# Altium schematic sheet Main.SchDoc
size A3; SheetNumber: 1; SheetTotal: 3
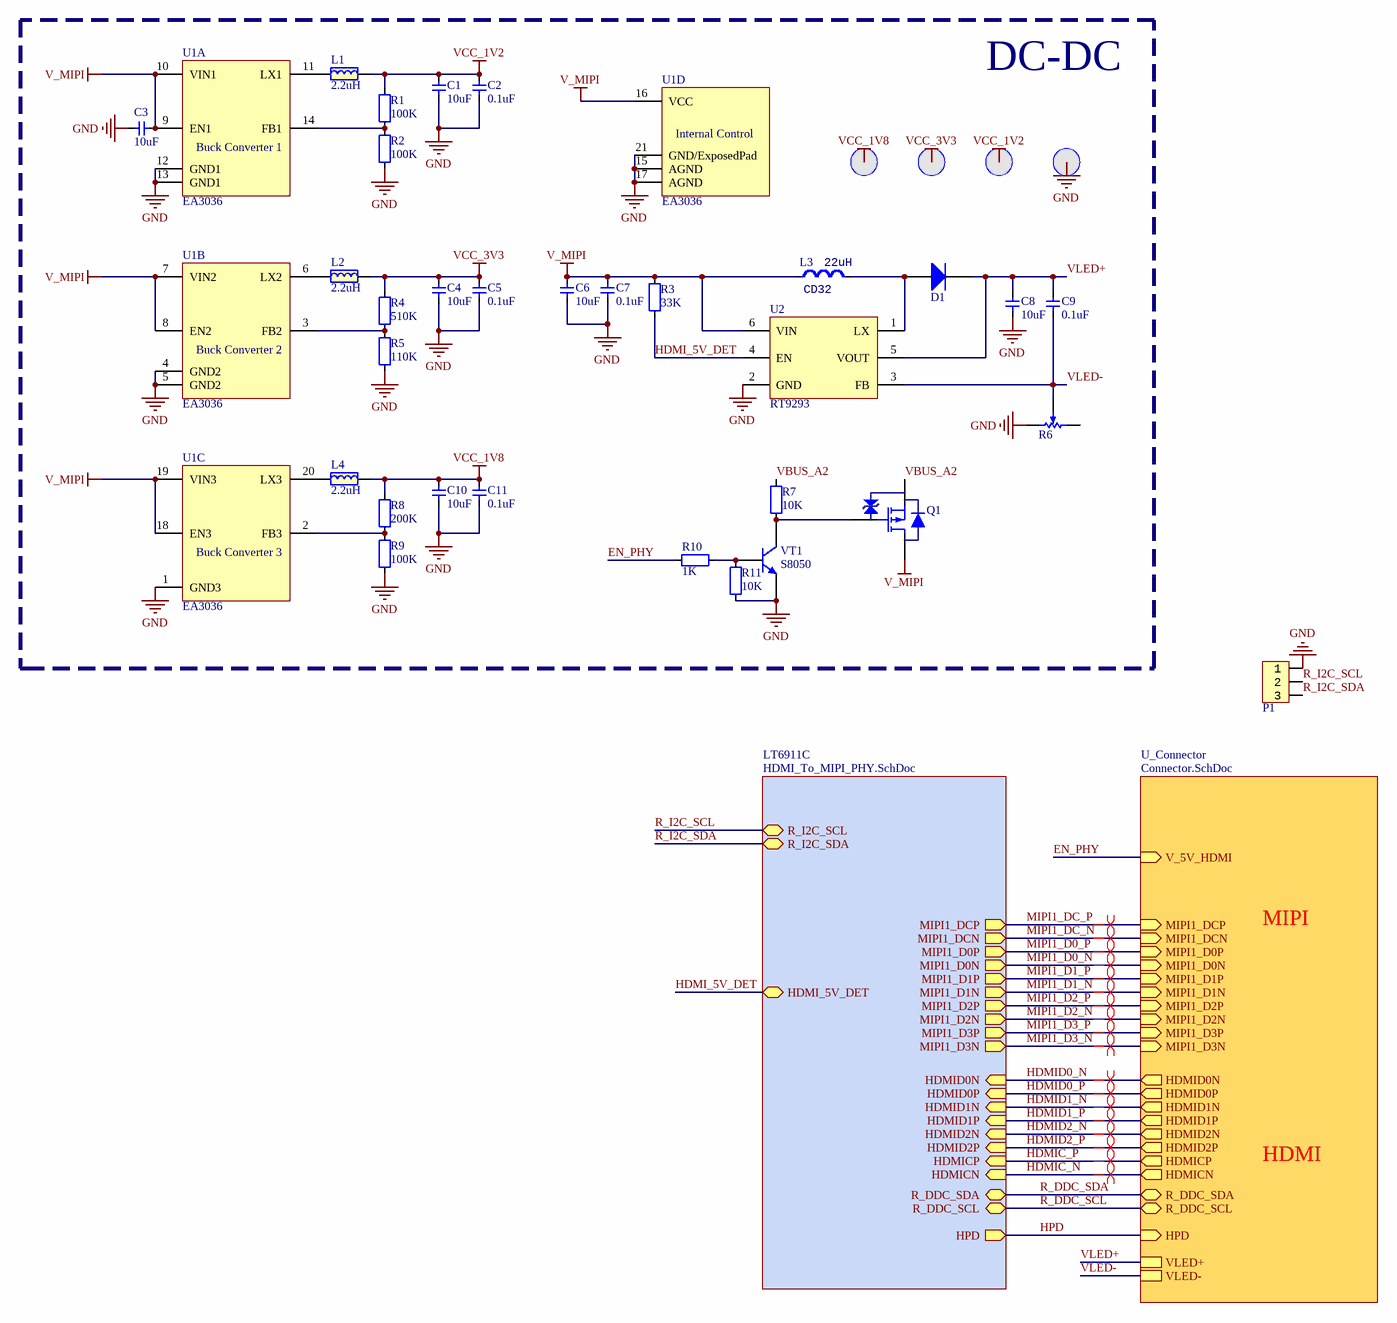
[diagram p0: Main.SchDoc]

## Parts
C1  10uF  [CAP_0402]
C2  0.1uF  [CAP_0402]
C3  10uF  [CAP_0402]
C4  10uF  [CAP_0402]
C5  0.1uF  [CAP_0402]
C6  10uF  [CAP_0402]
C7  0.1uF  [CAP_0402]
C8  10uF  [CAP_0402]
C9  0.1uF  [CAP_0402]
C10  10uF  [CAP_0402]
C11  0.1uF  [CAP_0402]
D1  二极管-5B5817WS  [SOD-323]  (value not drawn)
L1  2.2uH  [2520-L]
L2  2.2uH  [2520-L]
L3  value 22uH  [IND_CD32]  (hidden comment: CD32)
L4  2.2uH  [2520-L]
P1  HDR1x3_2.54  [HDR1X3_2.54_90]  (value not drawn)
Q1  AO3415A  [SOT23-3]  (value not drawn)
R1  100K  [RES_0402]
R2  100K  [RES_0402]
R3  33K  [RES_0402]
R4  510K  [RES_0402]
R5  110K  [RES_0402]
R6  电位器-贴片  [贴片电位器 3*3]  (value not drawn)
R7  10K  [RES_0402]
R8  200K  [RES_0402]
R9  100K  [RES_0402]
R10  1K  [RES_0402]
R11  10K  [RES_0402]
T1  测试点  [TEST_PT]  (value not drawn)
T2  测试点  [TEST_PT]  (value not drawn)
T3  测试点  [TEST_PT]  (value not drawn)
T4  测试点  [TEST_PT]  (value not drawn)
U1  EA3036  [QFN-20]  (parts A,B,C,D of 4)
U2  RT9293  [SOT23-6]
VT1  S8050  [SMT_TRIODE_NPN]

## Blocks framed on the sheet
DC-DC: C1-C11 D1 L1-L4 Q1 R1-R11 T1-T4 U1 U2 VT1

## Sub-sheets
LT6911C = HDMI_To_MIPI_PHY.SchDoc: R_I2C_SDA (bidir), R_I2C_SCL (bidir), HDMID0N (in), HDMID0P (in), HDMID1N (in), HDMID1P (in), HDMID2N (in), HDMID2P (in), HDMICP (in), HDMICN (in), R_DDC_SDA (bidir), R_DDC_SCL (bidir), MIPI1_DCP (out), MIPI1_DCN (out), MIPI1_D0P (out), MIPI1_D0N (out), MIPI1_D1P (out), MIPI1_D1N (out), MIPI1_D2P (out), MIPI1_D2N (out), MIPI1_D3P (out), MIPI1_D3N (out), HPD (out), HDMI_5V_DET (bidir)
U_Connector = Connector.SchDoc: MIPI1_DCP (in), MIPI1_DCN (in), MIPI1_D0P (in), MIPI1_D0N (in), MIPI1_D1P (in), MIPI1_D1N (in), MIPI1_D2P (in), MIPI1_D2N (in), MIPI1_D3P (in), MIPI1_D3N (in), R_DDC_SDA (bidir), R_DDC_SCL (bidir), HDMICP (out), HDMICN (out), HDMID0N (out), HDMID2P (out), HDMID1N (out), HDMID0P (out), HDMID1P (out), HDMID2N (out), HPD (in), VLED+, VLED-, V_5V_HDMI (in)

## Nets
GND: C1.2 C2.2 C3.1 C4.2 C5.2 C6.1 C7.1 C8.1 C10.2 C11.2 P1.1 R2.1 R5.1 R6.1(+) R9.1 R11.2 T4.0 U1.1(GND3) U1.4(GND2) U1.5(GND2) U1.12(GND1) U1.13(GND1) U1.15(AGND) U1.17(AGND) U1.21(GND/ExposedPad) U2.2(GND) VT1.2(E)
V_MIPI: C3.2 C6.2 C7.2 L3.1 Q1.3(D) R3.2 U1.7(VIN2) U1.8(EN2) U1.9(EN1) U1.10(VIN1) U1.16(VCC) U1.18(EN3) U1.19(VIN3) U2.6(VIN)
VCC_1V2: C1.1 C2.1 L1.2 R1.2 T3.0
VCC_1V8: C10.1 C11.1 L4.2 R8.2 T1.0
VCC_3V3: C4.1 C5.1 L2.2 R4.2 T2.0
EN_PHY: R10.2 ; sheet U_Connector/V_5V_HDMI
HDMI_5V_DET: R3.1 U2.4(EN) ; sheet LT6911C/HDMI_5V_DET
HDMIC_N: sheet LT6911C/HDMICN, sheet U_Connector/HDMICN
HDMIC_P: sheet LT6911C/HDMICP, sheet U_Connector/HDMICP
HDMID0_N: sheet LT6911C/HDMID0N, sheet U_Connector/HDMID0N
HDMID0_P: sheet LT6911C/HDMID0P, sheet U_Connector/HDMID0P
HDMID1_N: sheet LT6911C/HDMID1N, sheet U_Connector/HDMID1N
HDMID1_P: sheet LT6911C/HDMID1P, sheet U_Connector/HDMID1P
HDMID2_N: sheet LT6911C/HDMID2N, sheet U_Connector/HDMID2N
HDMID2_P: sheet LT6911C/HDMID2P, sheet U_Connector/HDMID2P
HPD: sheet LT6911C/HPD, sheet U_Connector/HPD
MIPI1_D0_N: sheet LT6911C/MIPI1_D0N, sheet U_Connector/MIPI1_D0N
MIPI1_D0_P: sheet LT6911C/MIPI1_D0P, sheet U_Connector/MIPI1_D0P
MIPI1_D1_N: sheet LT6911C/MIPI1_D1N, sheet U_Connector/MIPI1_D1N
MIPI1_D1_P: sheet LT6911C/MIPI1_D1P, sheet U_Connector/MIPI1_D1P
MIPI1_D2_N: sheet LT6911C/MIPI1_D2N, sheet U_Connector/MIPI1_D2N
MIPI1_D2_P: sheet LT6911C/MIPI1_D2P, sheet U_Connector/MIPI1_D2P
MIPI1_D3_N: sheet LT6911C/MIPI1_D3N, sheet U_Connector/MIPI1_D3N
MIPI1_D3_P: sheet LT6911C/MIPI1_D3P, sheet U_Connector/MIPI1_D3P
MIPI1_DC_N: sheet LT6911C/MIPI1_DCN, sheet U_Connector/MIPI1_DCN
MIPI1_DC_P: sheet LT6911C/MIPI1_DCP, sheet U_Connector/MIPI1_DCP
R_DDC_SCL: sheet LT6911C/R_DDC_SCL, sheet U_Connector/R_DDC_SCL
R_DDC_SDA: sheet LT6911C/R_DDC_SDA, sheet U_Connector/R_DDC_SDA
R_I2C_SCL: P1.2 ; sheet LT6911C/R_I2C_SCL
R_I2C_SDA: P1.3 ; sheet LT6911C/R_I2C_SDA
VBUS_A2: Q1.2(S) R7.2
VLED+: C8.2 C9.2 D1.2(K) U2.5(VOUT) ; sheet U_Connector/VLED+
VLED-: C9.1 R6.3(W) U2.3(FB) ; sheet U_Connector/VLED-
NetD1_1: D1.1(A) L3.2 U2.1(LX)
NetL1_1: L1.1 U1.11(LX1)
NetL2_1: L2.1 U1.6(LX2)
NetL4_1: L4.1 U1.20(LX3)
NetQ1_1: Q1.1(G) R7.1 VT1.3(C)
NetR1_1: R1.1 R2.2 U1.14(FB1)
NetR4_1: R4.1 R5.2 U1.3(FB2)
NetR8_1: R8.1 R9.2 U1.2(FB3)
NetR10_1: R10.1 R11.1 VT1.1(B)

Not connected (* = marked no-connect by the designer): R6 2(-)

## Layout directives
differential pair: HDMIC_N, HDMIC_P, HDMID0_N, HDMID0_P, HDMID1_N, HDMID1_P, HDMID2_N, HDMID2_P, MIPI1_D0_N, MIPI1_D0_P, MIPI1_D1_N, MIPI1_D1_P, MIPI1_D2_N, MIPI1_D2_P, MIPI1_D3_N, MIPI1_D3_P, MIPI1_DC_N, MIPI1_DC_P

## Notes on the sheet
- MIPI
- HDMI
- (in symbol EA3036, part A) Buck Converter 1
- (in symbol EA3036, part B) Buck Converter 2
- (in symbol EA3036, part C) Buck Converter 3
- (in symbol EA3036, part D) Internal Control

## Library data of the parts
C1-C11 = 电容-0402: Capacitor; Value: 0.1u
D1 = 二极管-5B5817WS: 40V
L1 L2 L4 = 电感-2520: 磁珠
L3 = Ind_CD32: Inductor; Specification: ±5% 100mA; Manufacturer: *; Type: CD32
P1 = HDR1x3_2.54T: Header
Q1 = AO3415A: MOSFET; Published: 8-Jun-2000; LatestRevisionDate: 17-Jul-2002; LatestRevisionNote: Re-released for DXP Platform.; PackageVersion: 1995/1996; PackageReference: E3; Publisher: Altium Limited; PackageDescription: TO, Flat Index; 3 In-Line, Axial Leads; Body Dia. 4.6mm; Lead Dia. 0.5 mm (max)
R1-R5 R7-R11 = 电阻-0402: Resistor; Value: 22R
U1 = EA3036: EA3036 is a 3CH power management IC for applications powered by one Li-Ion battery or a DC 5V adapter.
U2 = RT9293: LCD-LED Driver
VT1 = SMT_TRIODE_NPN: Surface mount NPN transistor, package SOT-23
R6 = 电位器-贴片: Published: 17-Dec-2003; DatasheetVersion: Oct-2003; PackageReference: POT4MM-2; Publisher: Altium Limited; PackageDescription: Square Trimming Potentiometer; ComponentLink1Description: Manufacturer Link; ComponentLink1URL: http://bourns.com/2/search.html